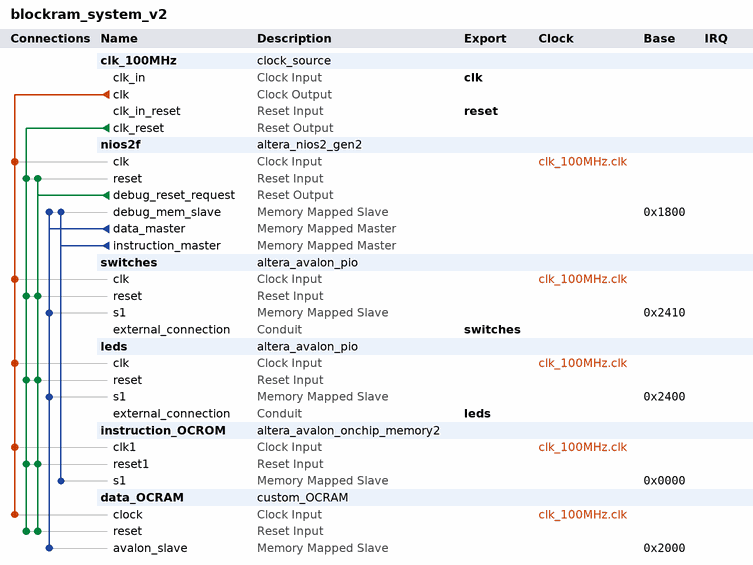
[diagram p0: system contents]
# Platform Designer (Qsys) system blockram_system_v2, Cyclone 10 LP 10CL025YE144C8G
# Parameters at their usual value, and those the tool derives, are not listed.
package require -exact qsys 22.1
create_system blockram_system_v2
set_project_property DEVICE_FAMILY {Cyclone 10 LP}
set_project_property DEVICE 10CL025YE144C8G

add_instance clk_100MHz clock_source 22.1
set_instance_parameter_value clk_100MHz clockFrequency 50000000

add_instance nios2f altera_nios2_gen2 22.1
set_instance_parameter_value nios2f dcache_bursts true
set_instance_parameter_value nios2f dcache_size 2048
set_instance_parameter_value nios2f exceptionSlave instruction_OCROM.s1
set_instance_parameter_value nios2f icache_burstType Sequential
set_instance_parameter_value nios2f icache_size 4096
set_instance_parameter_value nios2f impl Fast
set_instance_parameter_value nios2f resetSlave instruction_OCROM.s1

add_instance switches altera_avalon_pio 22.1
set_instance_parameter_value switches direction Input
set_instance_parameter_value switches width 4

add_instance leds altera_avalon_pio 22.1
set_instance_parameter_value leds direction Output
set_instance_parameter_value leds width 4

add_instance instruction_OCROM altera_avalon_onchip_memory2 22.1
set_instance_parameter_value instruction_OCROM dataWidth 32
set_instance_parameter_value instruction_OCROM dualPort false
set_instance_parameter_value instruction_OCROM initMemContent true
set_instance_parameter_value instruction_OCROM initializationFileName /home/andrea/Documents/Tesi_287628/287628/blockram_system_v2/SBT_workspace/blockram_system_v2/mem_init/blockram_system_v2_instruction_OCROM.hex
set_instance_parameter_value instruction_OCROM memorySize 4096
set_instance_parameter_value instruction_OCROM useNonDefaultInitFile true
set_instance_parameter_value instruction_OCROM writable false

add_instance data_OCRAM custom_OCRAM 1.1

# connections
add_connection clk_100MHz.clk data_OCRAM.clock clock
add_connection clk_100MHz.clk instruction_OCROM.clk1 clock
add_connection clk_100MHz.clk leds.clk clock
add_connection clk_100MHz.clk nios2f.clk clock
add_connection clk_100MHz.clk switches.clk clock
add_connection clk_100MHz.clk_reset data_OCRAM.reset reset
add_connection clk_100MHz.clk_reset instruction_OCROM.reset1 reset
add_connection clk_100MHz.clk_reset leds.reset reset
add_connection clk_100MHz.clk_reset nios2f.reset reset
add_connection clk_100MHz.clk_reset switches.reset reset
add_connection nios2f.debug_reset_request data_OCRAM.reset reset
add_connection nios2f.debug_reset_request instruction_OCROM.reset1 reset
add_connection nios2f.debug_reset_request leds.reset reset
add_connection nios2f.debug_reset_request nios2f.reset reset
add_connection nios2f.debug_reset_request switches.reset reset
add_connection nios2f.data_master data_OCRAM.avalon_slave avalon
set_connection_parameter_value nios2f.data_master/data_OCRAM.avalon_slave baseAddress 0x2000
add_connection nios2f.data_master leds.s1 avalon
set_connection_parameter_value nios2f.data_master/leds.s1 baseAddress 0x2400
add_connection nios2f.data_master nios2f.debug_mem_slave avalon
set_connection_parameter_value nios2f.data_master/nios2f.debug_mem_slave baseAddress 0x1800
add_connection nios2f.data_master switches.s1 avalon
set_connection_parameter_value nios2f.data_master/switches.s1 baseAddress 0x2410
add_connection nios2f.instruction_master instruction_OCROM.s1 avalon
set_connection_parameter_value nios2f.instruction_master/instruction_OCROM.s1 baseAddress 0x0000
add_connection nios2f.instruction_master nios2f.debug_mem_slave avalon
set_connection_parameter_value nios2f.instruction_master/nios2f.debug_mem_slave baseAddress 0x1800

# exported interfaces
add_interface clk clock sink
set_interface_property clk EXPORT_OF clk_100MHz.clk_in
add_interface leds conduit end
set_interface_property leds EXPORT_OF leds.external_connection
add_interface reset reset sink
set_interface_property reset EXPORT_OF clk_100MHz.clk_in_reset
add_interface switches conduit end
set_interface_property switches EXPORT_OF switches.external_connection

set_interconnect_requirement {$system} qsys_mm.clockCrossingAdapter HANDSHAKE
set_interconnect_requirement {$system} qsys_mm.enableEccProtection FALSE
set_interconnect_requirement {$system} qsys_mm.insertDefaultSlave FALSE
set_interconnect_requirement {$system} qsys_mm.maxAdditionalLatency 1

save_system blockram_system_v2.qsys
